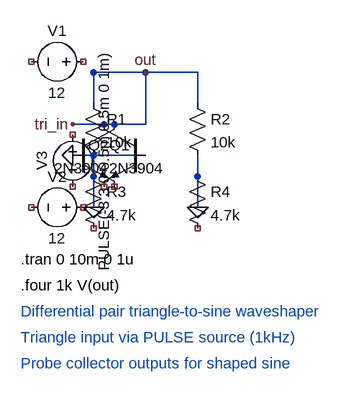
[diagram p0: schematic waveshaper.asc]
waveshaper.asc, the LTspice schematic file:
Version 4
SHEET 1 1200 800
WIRE 208 160 208 112
WIRE 208 272 208 240
WIRE 368 160 368 112
WIRE 368 272 368 240
WIRE 208 112 368 112
WIRE 288 192 176 192
WIRE 288 240 176 240
WIRE 208 320 208 272
WIRE 368 320 368 272
WIRE 208 112 288 112
WIRE 288 112 288 192
FLAG 208 320 0
FLAG 368 320 0
FLAG 176 192 tri_in
FLAG 176 240 0
FLAG 288 112 out
SYMBOL npn 176 192 R0
SYMATTR InstName Q1
SYMATTR Value 2N3904
SYMBOL npn 288 192 M0
SYMATTR InstName Q2
SYMATTR Value 2N3904
SYMBOL res 192 144 R0
SYMATTR InstName R1
SYMATTR Value 10k
SYMBOL res 352 144 R0
SYMATTR InstName R2
SYMATTR Value 10k
SYMBOL res 192 256 R0
SYMATTR InstName R3
SYMATTR Value 4.7k
SYMBOL res 352 256 R0
SYMATTR InstName R4
SYMATTR Value 4.7k
SYMBOL voltage 208 96 R90
WINDOW 0 -32 56 VBottom 2
WINDOW 3 32 56 VTop 2
SYMATTR InstName V1
SYMATTR Value 12
SYMBOL voltage 208 320 R90
WINDOW 0 -32 56 VBottom 2
WINDOW 3 32 56 VTop 2
SYMATTR InstName V2
SYMATTR Value 12
SYMBOL voltage 176 192 R0
WINDOW 0 -32 56 VBottom 2
WINDOW 3 32 56 VTop 2
SYMATTR InstName V3
SYMATTR Value PULSE(-3 3 0 0.5m 0.5m 0 1m)
TEXT 96 400 Left 2 !.tran 0 10m 0 1u
TEXT 96 440 Left 2 !.four 1k V(out)
TEXT 96 480 Left 2 ;Differential pair triangle-to-sine waveshaper
TEXT 96 520 Left 2 ;Triangle input via PULSE source (1kHz)
TEXT 96 560 Left 2 ;Probe collector outputs for shaped sine

The netlist it stands for:
* waveshaper.asc
Q1 out 0 NC_01 0 2N3904
Q2 out 0 NC_02 0 2N3904
R1 out 0 10k
R2 out 0 10k
R3 0 NC_03 4.7k
R4 0 NC_04 4.7k
V1 NC_05 NC_06 12
V2 NC_07 NC_08 12
V3 NC_09 NC_10 PULSE(-3 3 0 0.5m 0.5m 0 1m)
.model NPN NPN
.model PNP PNP
.lib standard.bjt
.tran 0 10m 0 1u
.four 1k V(out)
* Differential pair triangle-to-sine waveshaper
* Triangle input via PULSE source (1kHz)
* Probe collector outputs for shaped sine
.backanno
.end